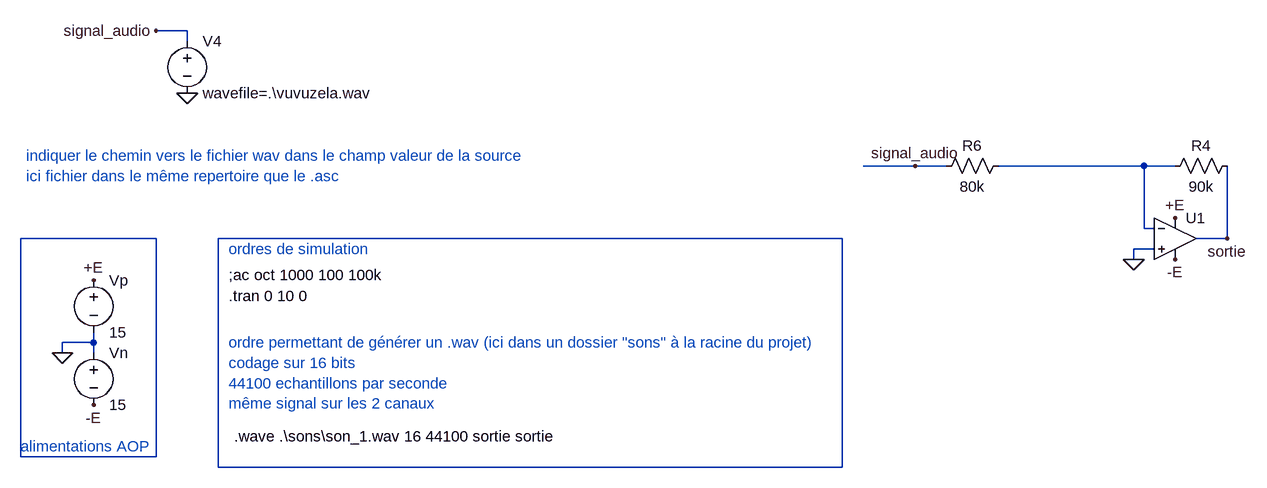
[diagram p0: schematic exemple_son_LTSpice.asc]
exemple_son_LTSpice.asc, the LTspice schematic file:
Version 4
SHEET 1 2136 680
WIRE -1664 -800 -1712 -800
WIRE -1664 -784 -1664 -800
WIRE -544 -592 -624 -592
WIRE -496 -592 -544 -592
WIRE -192 -592 -416 -592
WIRE -144 -592 -192 -592
WIRE -192 -496 -192 -592
WIRE -176 -496 -192 -496
WIRE -1712 -480 -1920 -480
WIRE -656 -480 -1616 -480
WIRE -64 -480 -64 -592
WIRE -64 -480 -112 -480
WIRE -176 -464 -208 -464
WIRE -208 -448 -208 -464
WIRE -1808 -320 -1808 -336
WIRE -1808 -320 -1856 -320
WIRE -1856 -304 -1856 -320
WIRE -1808 -304 -1808 -320
WIRE -1920 -144 -1920 -480
WIRE -1712 -144 -1712 -480
WIRE -1712 -144 -1920 -144
WIRE -1616 -128 -1616 -480
WIRE -656 -128 -656 -480
WIRE -656 -128 -1616 -128
FLAG -208 -448 0
FLAG -1856 -304 0
FLAG -1808 -416 +E
FLAG -1808 -224 -E
FLAG -144 -512 +E
FLAG -144 -448 -E
FLAG -64 -480 sortie
FLAG -1664 -704 0
FLAG -1712 -800 signal_audio
FLAG -544 -592 signal_audio
SYMBOL res -48 -608 R90
WINDOW 0 0 56 VBottom 2
WINDOW 3 32 56 VTop 2
SYMATTR InstName R4
SYMATTR Value 90k
SYMBOL voltage -1808 -432 R0
WINDOW 123 0 0 Left 2
WINDOW 39 0 0 Left 2
SYMATTR InstName Vp
SYMATTR Value 15
SYMBOL voltage -1808 -320 R0
WINDOW 123 0 0 Left 2
WINDOW 39 0 0 Left 2
SYMATTR InstName Vn
SYMATTR Value 15
SYMBOL Opamps\\UniversalOpamp2 -144 -480 R0
SYMATTR InstName U1
SYMBOL voltage -1664 -800 R0
WINDOW 123 0 0 Left 2
WINDOW 39 0 0 Left 2
SYMATTR InstName V4
SYMATTR Value wavefile=.\vuvuzela.wav
SYMBOL res -400 -608 R90
WINDOW 0 0 56 VBottom 2
WINDOW 3 32 56 VTop 2
SYMATTR InstName R6
SYMATTR Value 80k
TEXT -1600 -424 Left 2 !;ac oct 1000 100 100k
TEXT -1920 -160 Left 2 ;alimentations AOP
TEXT -1600 -464 Left 2 ;ordres de simulation
TEXT -1592 -176 Left 2 !.wave .\\sons\\son_1.wav 16 44100 sortie sortie
TEXT -1600 -392 Left 2 !.tran 0 10 0
TEXT -1912 -608 Left 2 ;indiquer le chemin vers le fichier wav dans le champ valeur de la source\nici fichier dans le même repertoire que le .asc
TEXT -1600 -320 Left 2 ;ordre permettant de générer un .wav (ici dans un dossier "sons" à la racine du projet)\ncodage sur 16 bits\n44100 echantillons par seconde\nmême signal sur les 2 canaux

The netlist it stands for:
* exemple_son_LTSpice.asc
R4 sortie N001 90k
Vp +E 0 15
Vn 0 -E 15
XU1 0 N001 +E -E sortie level.2 Avol=1Meg GBW=10Meg Slew=10Meg ilimit=25m rail=0 Vos=0 phimargin=45 en=0 enk=0 in=0 ink=0 Rin=500Meg  ; pins IN+ IN- V+ V- OUT
V4 signal_audio 0 wavefile=.\vuvuzela.wav
R6 N001 signal_audio 80k
;ac oct 1000 100 100k
* alimentations AOP
* ordres de simulation
.wave .\sons\son_1.wav 16 44100 sortie sortie
.tran 0 10 0
* indiquer le chemin vers le fichier wav dans le champ valeur de la source
* ici fichier dans le même repertoire que le .asc
* ordre permettant de générer un .wav (ici dans un dossier "sons" à la racine du projet)
* codage sur 16 bits
* 44100 echantillons par seconde
* même signal sur les 2 canaux
.lib UniversalOpamps2.sub
.backanno
.end